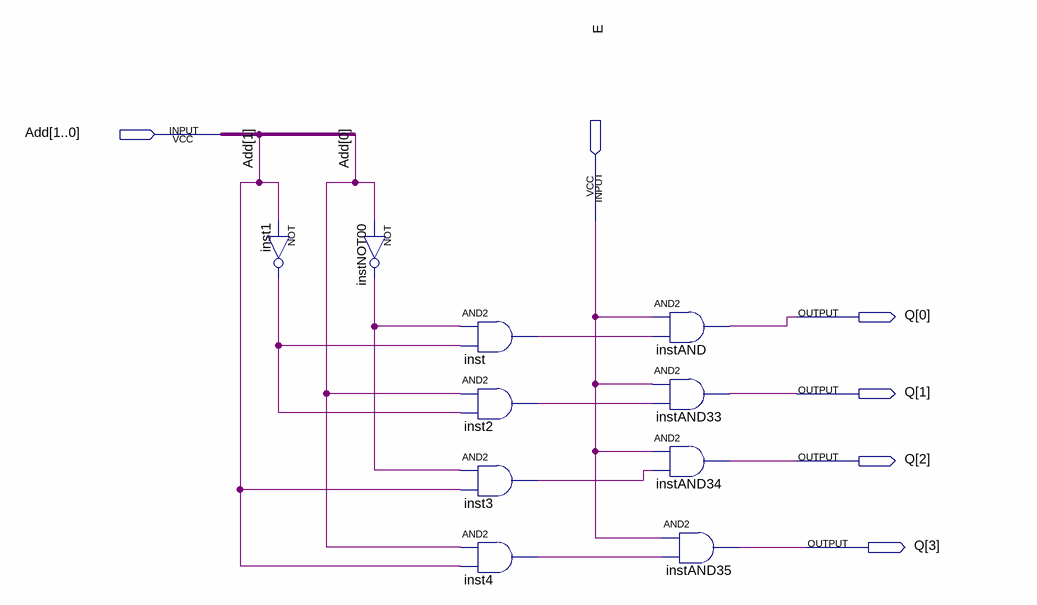
[diagram p0: schematic sheet]
// Quartus schematic Decode2To4.bdf as structural Verilog: 10 symbols, 6 pins
module Decode2To4 (
  input  [1:0] Add,
  input  E,
  output [3:0] Q
);

  wire inst1_out, inst2_out, inst3_out, inst4_out, inst_out, instNOT00_out;

  not inst1 (inst1_out, Add[1]);
  not instNOT00 (instNOT00_out, Add[0]);
  and inst (inst_out, instNOT00_out, inst1_out);
  and inst2 (inst2_out, Add[0], inst1_out);
  and inst3 (inst3_out, instNOT00_out, Add[1]);
  and inst4 (inst4_out, Add[0], Add[1]);
  and instAND (Q[0], E, inst_out);
  and instAND33 (Q[1], E, inst2_out);
  and instAND34 (Q[2], E, inst3_out);
  and instAND35 (Q[3], E, inst4_out);
endmodule
